# EAGLE schematic a003_camera (EAGLE 9.7.0)
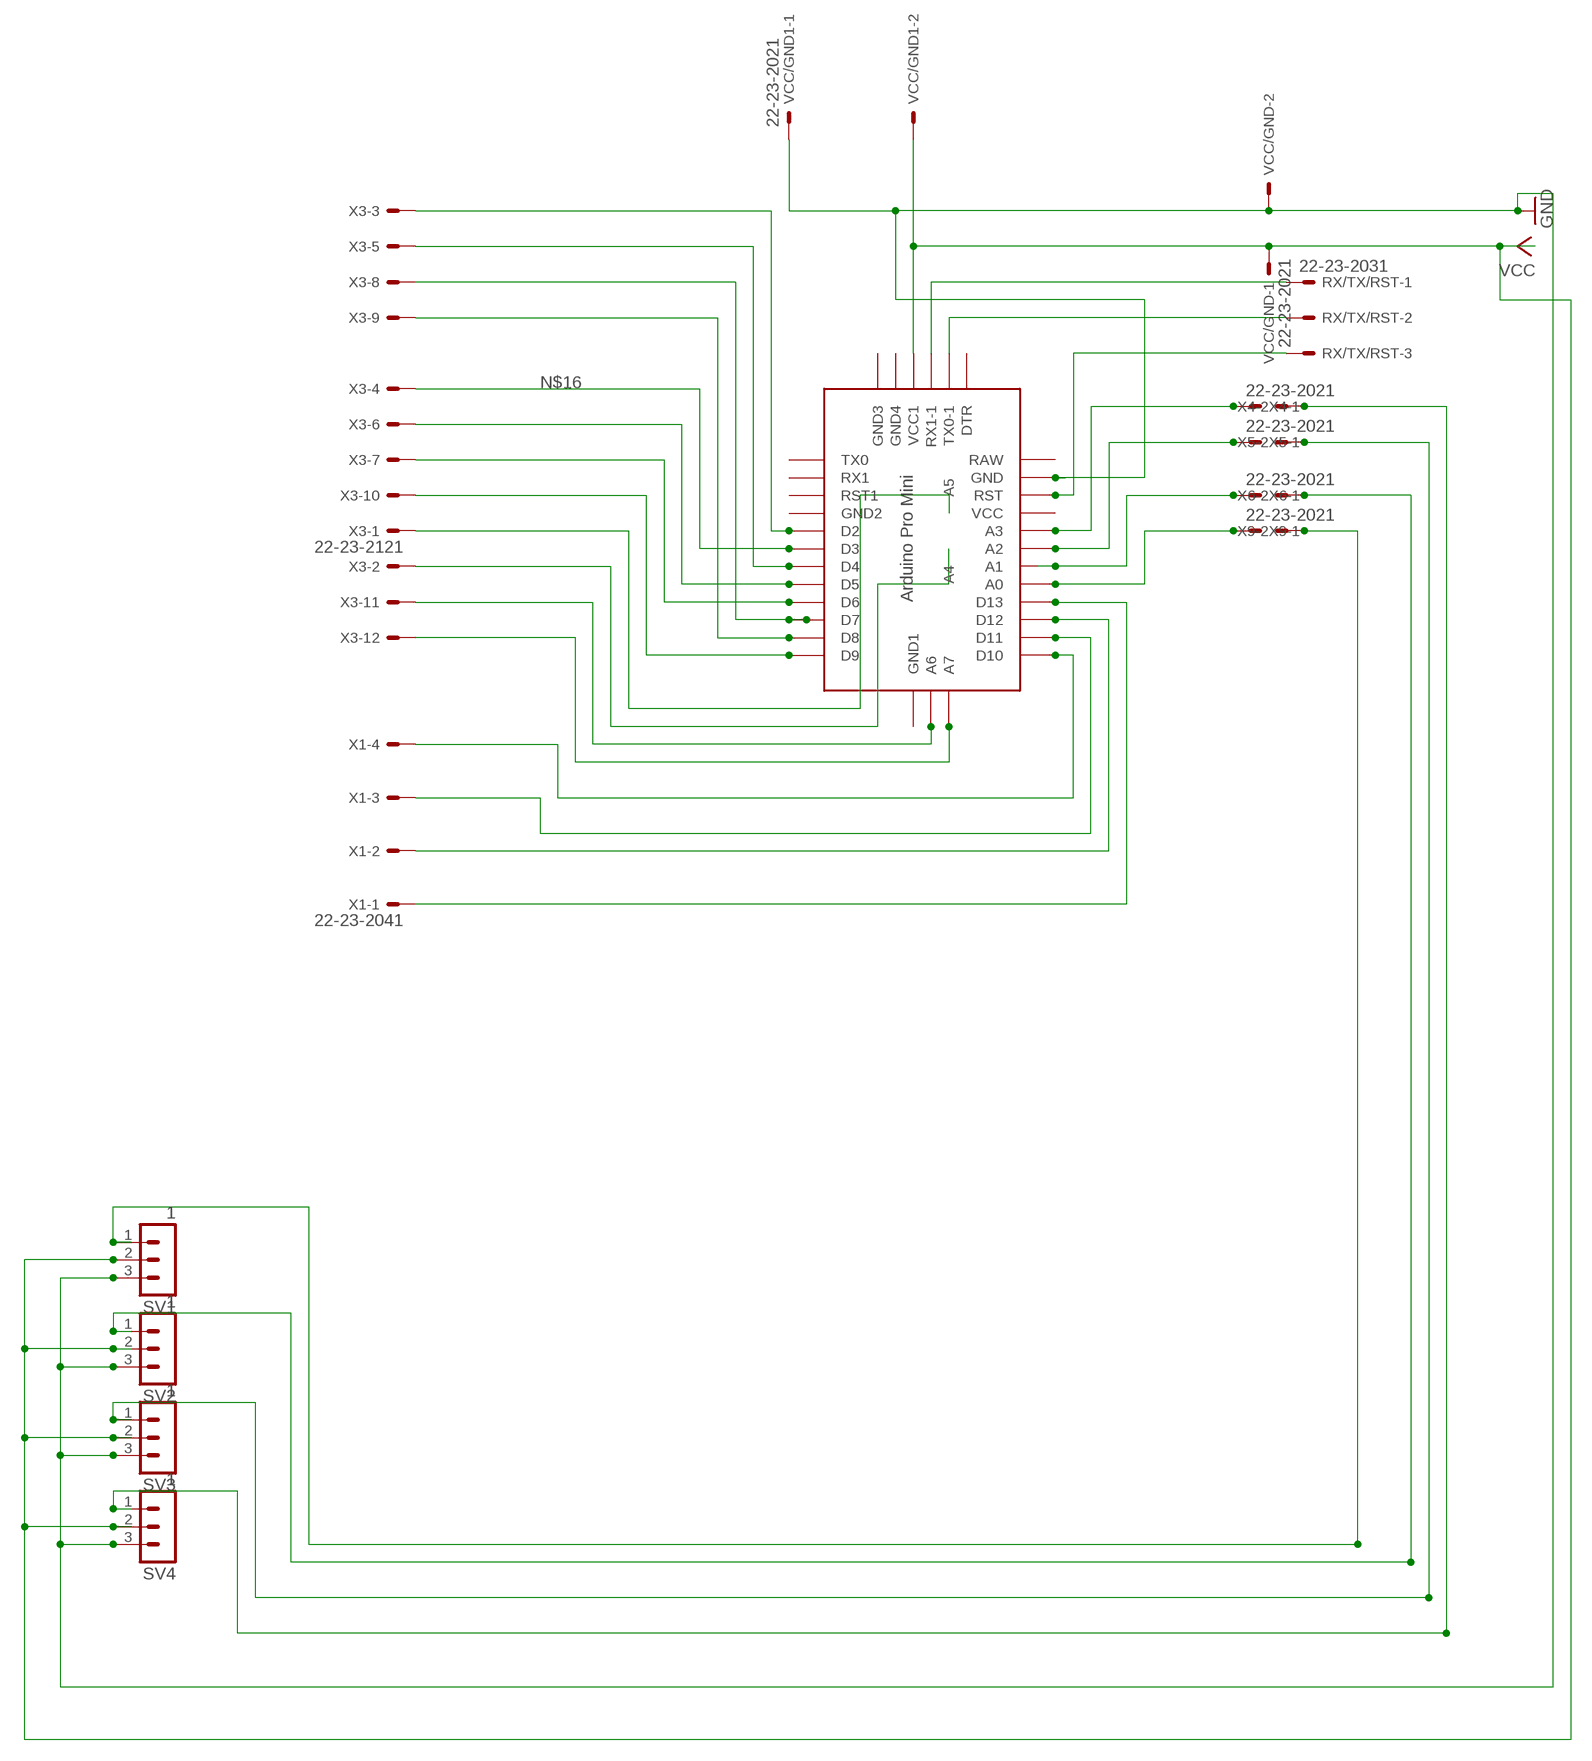
[diagram p0: schematic, sheet 1]

## Parts
RX/TX/RST  22-23-2031  [22-23-2031]
SV1  1  MA03-1  [MA03-1]
SV2  1  MA03-1  [MA03-1]
SV3  1  MA03-1  [MA03-1]
SV4  1  MA03-1  [MA03-1]
U$1  ABK-PRO-MINI  [ABK-PRO-MINI]
VCC/GND  22-23-2021  [22-23-2021]
VCC/GND1  22-23-2021  [22-23-2021]
X1  22-23-2041  [22-23-2041]
X3  22-23-2121  [22-23-2121]
X4  22-23-2021  [22-23-2021]
X5  22-23-2021  [22-23-2021]
X6  22-23-2021  [22-23-2021]
X9  22-23-2021  [22-23-2021]

## Nets
GND: SV1.3 SV2.3 SV3.3 SV4.3 U$1.GND VCC/GND1.1 VCC/GND.2
N$1: RX/TX/RST.2 U$1.TX0-1
N$2: U$1.A3 X4.1
N$3: U$1.D10 X1.4
N$4: U$1.A2 X5.1
N$5: RX/TX/RST.3 U$1.RST
N$6: SV4.1 X4.2
N$7: SV3.1 X5.2
N$8: SV2.1 X6.2
N$9: SV1.1 X9.2
N$10: U$1.D4 X3.5
N$11: U$1.D7 X3.8
N$12: U$1.D8 X3.9
N$13: U$1.D2 X3.3
N$14: U$1.D3 X3.4
N$15: U$1.D5 X3.6
N$16: U$1.D6 X3.7
N$17: U$1.D9 X3.10
N$18: U$1.A5 X3.1
N$19: U$1.A4 X3.2
N$20: U$1.A6 X3.11
N$21: U$1.A7 X3.12
N$22: U$1.A1 X6.1
N$23: RX/TX/RST.1 U$1.RX1-1
N$24: U$1.D11 X1.3
N$25: U$1.D12 X1.2
N$26: U$1.D13 X1.1
N$32: U$1.A0 X9.1
VCC: SV1.2 SV2.2 SV3.2 SV4.2 U$1.VCC1 VCC/GND1.2 VCC/GND.1
Unconnected: U$1.DTR U$1.GND1(GND2) U$1.GND2(GND3) U$1.GND3(GND4) U$1.GND4(GND1) U$1.RAW U$1.RST1 U$1.RX1 U$1.TX0 U$1.VCC

## Library data of the parts
RX/TX/RST = con-molex:22-23-2031: .100" (2.54mm) Center Header - 3 Pin; MF: MOLEX; MPN: 22-23-2031; OC_FARNELL: 1462950; OC_NEWARK: 30C0862
SV1-SV4 = con-lstb:MA03-1: PIN HEADER; OC_FARNELL: unknown; OC_NEWARK: unknown
U$1 = Arduino-clone:ABK-PRO-MINI: ABK Pro-Mini Arduino Clone
VCC/GND VCC/GND1 X4-X6 X9 = con-molex:22-23-2021: .100" (2.54mm) Center Header - 2 Pin; MF: MOLEX; MPN: 22-23-2021; OC_FARNELL: 1462926; OC_NEWARK: 25C3832
X1 = con-molex:22-23-2041: .100" (2.54mm) Center Header - 4 Pin; MF: MOLEX; MPN: 22-23-2041; OC_FARNELL: 1462920; OC_NEWARK: 38C0355
X3 = con-molex:22-23-2121: .100" (2.54mm) Center Header - 12 Pin; MF: MOLEX; MPN: 22-23-2121; OC_FARNELL: 1462935; OC_NEWARK: 56H0456